# Altium schematic sheet ArDINo Controller.SchDoc: document title
size C; ApprovedBy: Vincent Himpe; CheckedBy: Vincent Himpe; Author: Vincent Himpe; CompanyName: STMicroelectronics; DrawnBy: Vincent Himpe; Organization: BCD Application; Address1: 2525 Augustine Drive; Address2: Santa Clara 95054 CA; Address3: USA; Revision: A; Project: Project title; DrawnByContact: +1 (408) 451 8116; DrawnByEmail: vincent.himpe@st.com
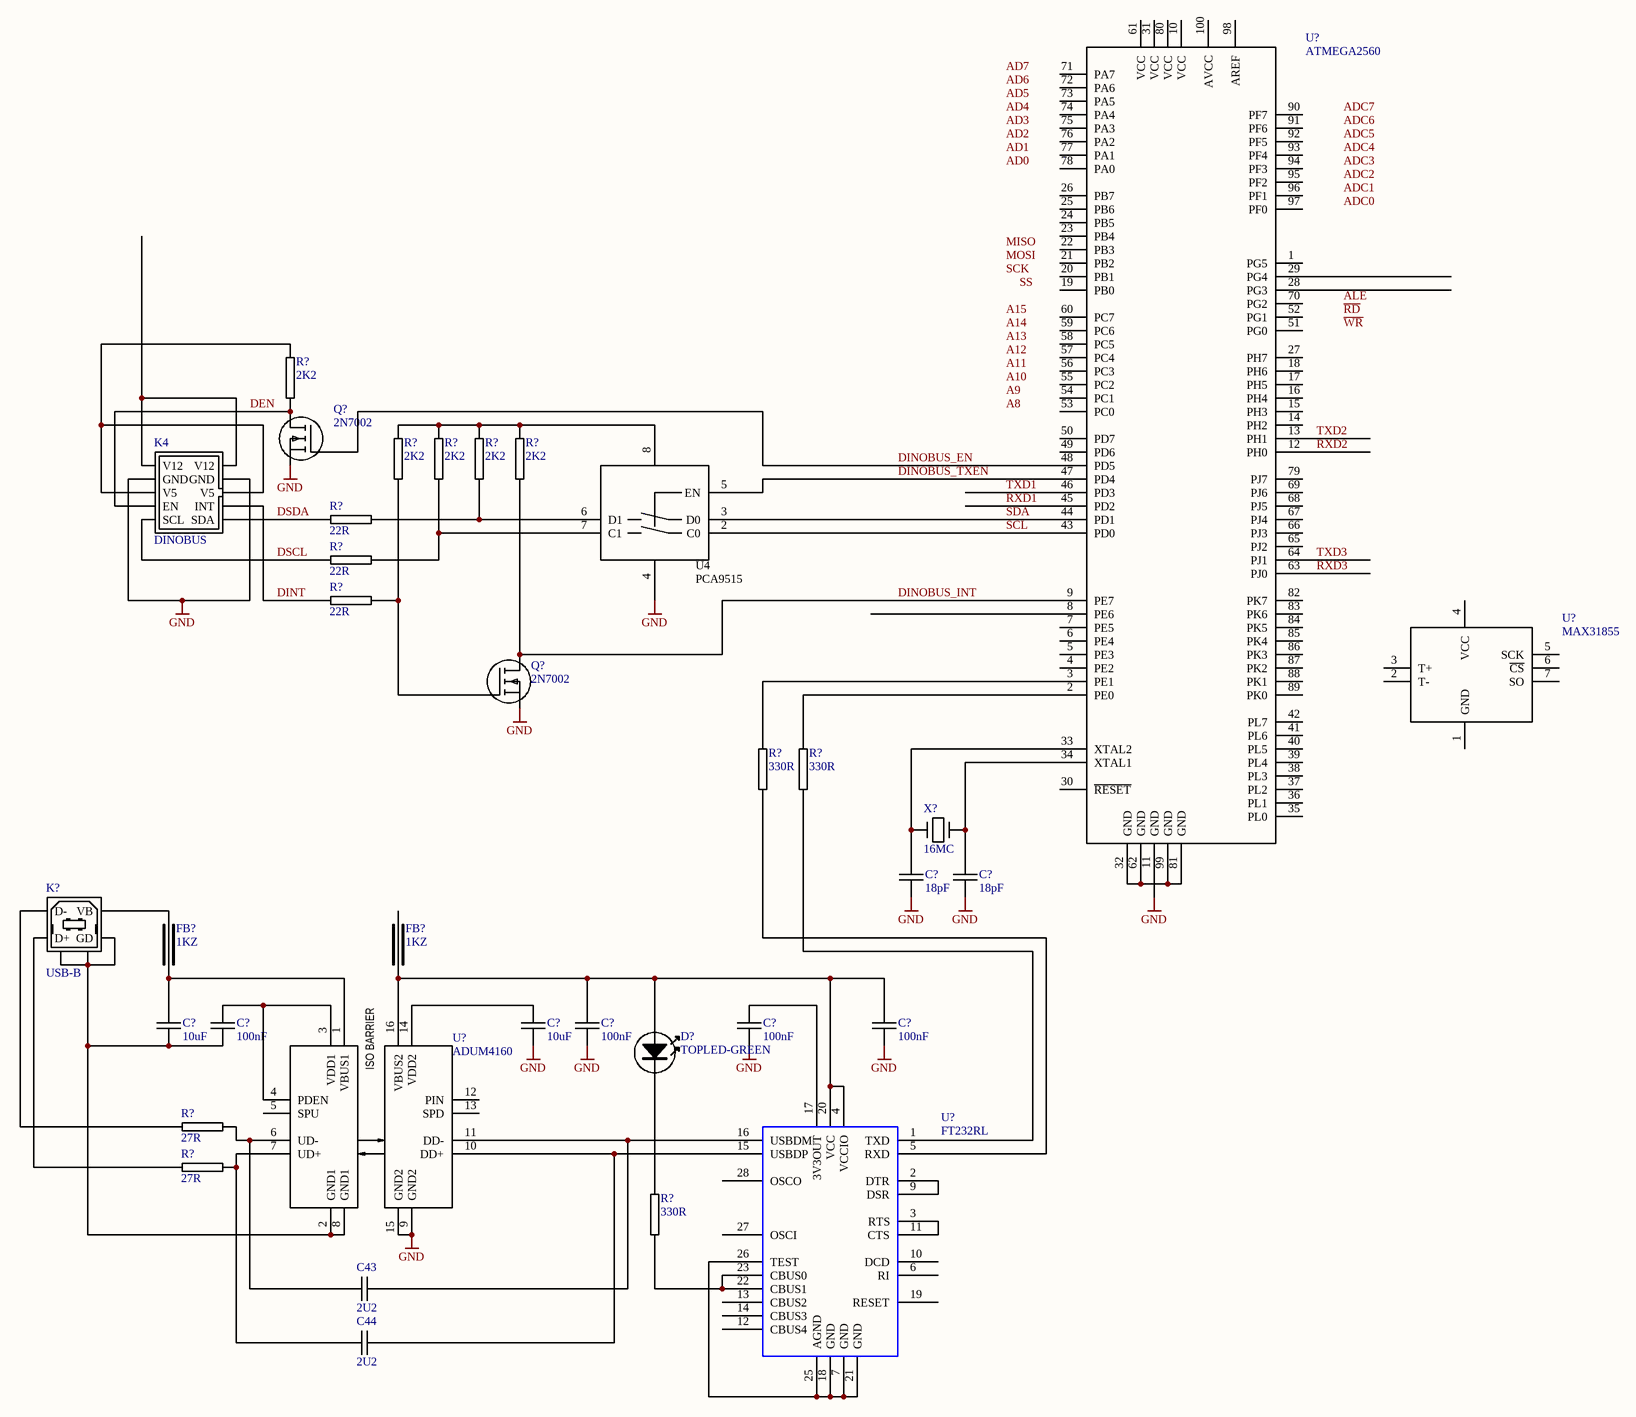
[diagram p0: ArDINo Controller.SchDoc]

## Parts
(Parts that share a designator on the sheet are numbered #1, #2 ... from top to bottom, then left to right.)
C43  2U2  [1206C-GENERIC]
C44  2U2  [1206C-GENERIC]
C?#1  18pF  [0805C-TBD]
C?#2  18pF  [0805C-TBD]
C?#3  10uF  [0805C-GENERIC]
C?#4  100nF  [0805C-TBD]
C?#5  10uF  [0805C-GENERIC]
C?#6  100nF  [0805C-TBD]
C?#7  100nF  [0805C-TBD]
C?#8  100nF  [0805C-TBD]
D?  TOPLED-GREEN  [TOPLED-GREEN]
FB?#1  1KZ  [0805FB-1KZ]
FB?#2  1KZ  [0805FB-1KZ]
K4  DINOBUS  [IDC10-B]
K?  USB-B  [USB-B]
Q?#1  2N7002  [SOT23-GDS]
Q?#2  2N7002  [SOT23-GDS]
R?#1  2K2  [0805R-2K2]
R?#2  2K2  [0805R-2K2]
R?#3  2K2  [0805R-2K2]
R?#4  2K2  [0805R-2K2]
R?#5  2K2  [0805R-2K2]
R?#6  22R  [0805R-22]
R?#7  22R  [0805R-22]
R?#8  22R  [0805R-22]
R?#9  330R  [0805R-330]
R?#10  330R  [0805R-330]
R?#11  27R  [0805R-27]
R?#12  27R  [0805R-27]
R?#13  330R  [0805R-330]
U4  PCA9515  [SO8]
U?#1  ATMEGA2560
U?#2  MAX31855
U?#3  ADUM4160
U?#4  FT232RL  [TSSOP28]
X?  16MC  [XTAL-RU49/4]

## Nets
GND: C?#1.2 C?#2.2 C?#5.2 C?#6.2 C?#7.2 C?#8.2 K4.3(GND) K4.4(GND) Q?#1.S Q?#2.S U4.4(GND) U?#1.11(GND) U?#3.9(GND2) U?#3.15(GND2)
DEN: K4.8(EN) Q?#1.D R?#1.2
DINOBUS_EN: Q?#1.G U?#1.48(PD5)
DINOBUS_INT: Q?#2.D R?#5.2 U?#1.9(PE7)
DINOBUS_TXEN: U4.5(EN) U?#1.47(PD4)
DINT: K4.7(INT) R?#8.1
DSCL: K4.10(SCL) R?#7.1
DSDA: K4.9(SDA) R?#6.1
RXD1: U?#1.45(PD2)
RXD2: U?#1.12(PH0)
RXD3: U?#1.63(PJ0)
SCL: U4.2(C0) U?#1.43(PD0)
SDA: U4.3(D0) U?#1.44(PD1)
TXD1: U?#1.46(PD3)
TXD2: U?#1.13(PH1)
TXD3: U?#1.64(PJ1)
NetC43_1: C43.1 R?#11.2 U?#3.6(UD-)
NetC43_2: C43.2 U?#3.11(DD-) U?#4.16(USBDM)
NetC44_1: C44.1 R?#12.2 U?#3.7(UD+)
NetC44_2: C44.2 U?#3.10(DD+) U?#4.15(USBDP)
NetC?#1_1: C?#1.1 U?#1.33(XTAL2) X?.1
NetC?#2_1: C?#2.1 U?#1.34(XTAL1) X?.2
NetC?#3_1: C?#3.1 FB?#1.2 U?#3.1(VBUS1)
NetC?#3_2: C?#3.2 C?#4.2 K?.4(GD) K?.5 K?.6 U?#3.2(GND1) U?#3.8(GND1)
NetC?#4_1: C?#4.1 U?#3.3(VDD1) U?#3.4(PDEN)
NetC?#5_1: C?#5.1 U?#3.14(VDD2)
NetC?#6_1: C?#6.1 C?#8.1 D?.A FB?#2.2 U?#3.16(VBUS2) U?#4.4(VCCIO) U?#4.20(VCC)
NetC?#7_1: C?#7.1 U?#4.17(3V3OUT)
NetD?_K: D?.K R?#13.1
NetFB?#1_1: FB?#1.1 K?.1(VB)
NetK4_1: K4.1(V12) K4.2(V12)
NetK4_5: K4.5(V5) K4.6(V5) R?#1.1
NetK?_2: K?.2(D-) R?#11.1
NetK?_3: K?.3(D+) R?#12.1
NetQ?#2_G: Q?#2.G R?#2.2 R?#8.2
NetR?#2_1: R?#2.1 R?#3.1 R?#4.1 R?#5.1 U4.8(VCC)
NetR?#3_2: R?#3.2 R?#7.2 U4.7(C1)
NetR?#4_2: R?#4.2 R?#6.2 U4.6(D1)
NetR?#9_1: R?#9.1 U?#1.3(PE1)
NetR?#9_2: R?#9.2 U?#4.5(RXD)
NetR?#10_1: R?#10.1 U?#1.2(PE0)
NetR?#10_2: R?#10.2 U?#4.1(TXD)
NetR?#13_2: R?#13.2 U?#4.22(CBUS1) U?#4.23(CBUS0)
NetU?#1_32: U?#1.32(GND) U?#1.62(GND) U?#1.81(GND) U?#1.99(GND)
NetU?#4_2: U?#4.2(DTR) U?#4.9(DSR)
NetU?#4_3: U?#4.3(RTS) U?#4.11(CTS)
NetU?#4_7: U?#4.7(GND) U?#4.18(GND) U?#4.21(GND) U?#4.25(AGND) U?#4.26(TEST)

Not connected (* = marked no-connect by the designer): FB?#2 1; U?#1 1(PG5) 4(PE2) 5(PE3) 6(PE4) 7(PE5) 8(PE6) 10(VCC) 14(PH2) 15(PH3) 16(PH4) 17(PH5) 18(PH6) 19(PB0) 20(PB1) 21(PB2) 22(PB3) 23(PB4) 24(PB5) 25(PB6) 26(PB7) 27(PH7) 28(PG3) 29(PG4) 30(~{RESET}) 31(VCC) 35(PL0) 36(PL1) 37(PL2) 38(PL3) 39(PL4) 40(PL5) 41(PL6) 42(PL7) 49(PD6) 50(PD7) 51(PG0) 52(PG1) 53(PC0) 54(PC1) 55(PC2) 56(PC3) 57(PC4) 58(PC5) 59(PC6) 60(PC7) 61(VCC) 65(PJ2) 66(PJ3) 67(PJ4) 68(PJ5) 69(PJ6) 70(PG2) 71(PA7) 72(PA6) 73(PA5) 74(PA4) 75(PA3) 76(PA2) 77(PA1) 78(PA0) 79(PJ7) 80(VCC) 82(PK7) 83(PK6) 84(PK5) 85(PK4) 86(PK3) 87(PK2) 88(PK1) 89(PK0) 90(PF7) 91(PF6) 92(PF5) 93(PF4) 94(PF3) 95(PF2) 96(PF1) 97(PF0) 98(AREF) 100(AVCC); U?#2 1(GND) 2(T-) 3(T+) 4(VCC) 5(SCK) 6(~{CS}) 7(SO); U?#3 5(SPU) 12(PIN) 13(SPD); U?#4 6(RI) 10(DCD) 12(CBUS4) 13(CBUS2) 14(CBUS3) 19(RESET) 27(OSCI) 28(OSCO)

## Notes on the sheet
- Labels drawn without touching a wire or pin: A8, A9, A10, A11, A12, A13, A14, A15, AD0, AD1, AD2, AD3, AD4, AD5, AD6, AD7, ADC0, ADC1, ADC2, ADC3, ADC4, ADC5, ADC6, ADC7, ALE, MISO, MOSI, SCK, SS, ~{RD}, ~{WR}
- PROJECT
- STMicroelectronics
- Last Modified
- Sheet
- of
- Document
- Revision
- Drawn By
- Information in this document is the intellectual property of STMicroelectronics.Disclosure outside of STMicroelectronics is prohibited without prior written approval. Contents may be subject to Patent or Patent application.
- 2525 Augustine Drive
- Santa Clara 95054 CA
- USA
- (in symbol ADUM4160) ISO BARRIER

## Library data of the parts
C43 C44 = 1206C-2U2-50V: CAPACITOR 0603 CERAMIC; REEL: C100; Supplier 1: Digi-Key; Supplier Part Number 1: 490-4796-2-ND
C?#1 C?#2 = 0805C-18PF-50V-C0G-JOH: CAPACITOR 0805 CERAMIC; Supplier 1: Digi-Key; Supplier Part Number 1: 709-1171-2-ND
C?#3 C?#5 = 0805C-10UF-6V3-X5R-PAN: CAPACITOR 0805 CERAMIC; Manufacturer: Panasonic - ECG; Manufacturer Part Number: ECJ-2FB0J106M; Reel: C1; Capacitance: 10µF; Voltage - Rated: 6.3V; Temperature Coefficient: X5R; Tolerance: ±20%; Description: CAP 10UF 6.3V CERAMIC X5R 0805; Supplier 1: Digi-Key; Supplier Part Number 1: PCC2225TR-ND; Supplier: Digi-Key; Operating Temperature: -55°C ~ 85°C; Mounting Type: Surface Mount, MLCC; Lead Spacing: -; RoHS: RoHS Compliant; Packaging: Tape & Reel (TR); Thickness: 1.25mm; Package / Case: 0805 (2012 metric); Features: General Purpose; Category: Capacitors; Supplier Part Number: PCC2225TR-ND
C?#4 C?#6-C?#8 = 0805C-100nF-25V-X7R-MUR: CAPACITOR 0805 CERAMIC; Supplier 1: Digi-Key; Supplier Part Number 1: 490-1673-1-ND
FB?#1 FB?#2 = 0805FB-1KZ: FERRITE BEAD 1000 OHM 6A; Reel: F3
K4 = DINOBUS: BOXHEADER 10 PIN; Manufacturer: Assmann Electronics Inc; Manufacturer Part Number: AWHW10G-0202-T-R; Connector Type: Header, Shrouded; Description: CONN HEADER LOW-PRO 10POS GOLD; Number of Positions: 10; Number of Positions Loaded: All; Pitch: 0.100" (2.54mm); Supplier 1: Digi-Key; Supplier Part Number 1: HRP10H-ND; Supplier: Digi-Key; Contact Type: Male Pin; RoHS: RoHS Compliant; Supplier Part Number: HRP10H-ND; Category: Connectors, Interconnects; Number of Rows: 2; Row Spacing: 0.100" (2.54mm); Contact Mating Length: -; Mounting Type: Through Hole; Termination: Solder; Fastening Type: -; Features: -; Contact Finish: Gold; Contact Finish Thickness: Flash; Color: Gray; Packaging: Tray
K? = USB-B: USB B DEVICE CONNECTOR; Text Field1: Assmann; Text Field2: AU-Y1007; Text Field3: Digi-Key; Text Field4: AE1085-ND; Text Field5: Thru-Hole; Text Field6: 1.168; NI?: *; O?: *; Section:: *
Q?#1 Q?#2 = 2N7002-SOT23: N CHANNEL MOSFET 2N7002 SOT23; Manufacturer: Fairchild Semiconductor; Drain to Source Voltage (Vdss): 60V; Vgs(th) (Max) @ Id: 2.5V @ 250µA; Power - Max: 200mW; Current - Continuous Drain (Id) @ 25° C: 115mA; Rds On (Max) @ Id, Vgs: 7.5 Ohm @ 500mA, 10V; FET Type: MOSFET N-Channel, Metal Oxide; FET Feature: Logic Level Gate; Input Capacitance (Ciss) @ Vds: 50pF @ 25V; Description: MOSFET N-CH 60V 115MA SOT-23; Reel: Q2; Supplier 1: Digi-Key; Supplier Part Number 1: 2N7002NTR-ND; Package / Case: SOT-23-3, TO-236-3, Micro3™, SSD3, SST3; RoHS: RoHS Compliant; Mounting Type: Surface Mount; Packaging: Tape & Reel (TR); Gate Charge (Qg) @ Vgs: -; Supplier Part Number: 2N7002NTR-ND; Supplier: Digi-Key; Category: Discrete Semiconductor Products; Manufacturer Part Number: 2N7002
R?#1-R?#5 = 0805R-2K2: RESISTOR 0805 1/4 WATT THIN FILM; Reel: *
R?#6-R?#8 = 0805R-22: RESISTOR 0805 1/4 WATT THIN FILM; Reel: *
R?#9 R?#10 R?#13 = 0805R-330: RESISTOR 0805 1/4 WATT THIN FILM; Reel: *
R?#11 R?#12 = 0805R-27: RESISTOR 0805 1/4 WATT THIN FILM; Reel: *
U4 = PCA9515: I2 BUS ISOLATOR; Supplier 1: Digi-Key; Supplier Part Number 1: 568-1031-6-ND
U?#1 = ATMEGA2560: ATMEL ATMEGA CPU; Supplier 1: Digi-Key; Supplier Part Number 1: ATMEGA2560-16AUR-ND
U?#3 = ADUM4160: USB Isolator; Supplier 1: Digi-Key; Supplier Part Number 1: ADUM4160BRWZ-ND
U?#4 = FT232RL: USB TO UART INTERFACE; Manufacturer: FTDI, Future Technology Devices International Ltd; Manufacturer Part Number: FT232RL R; Number of Channels: 8; Description: IC USB TO SERIAL UART 28-SSOP; Voltage: 3.3 V ~ 5.25 V; FIFO's: 256 Byte; Supplier 1: Digi-Key; Supplier Part Number 1: 768-1007-2-ND; RoHS: RoHS Compliant; Features: Serial Interface; Package / Case: 28-SSOP; Supplier: Digi-Key; Packaging: Tape & Reel (TR); Supplier Part Number: 768-1007-2-ND; Category: Integrated Circuits (ICs)
X? = 16MC-HC49US: 16MHz; Supplier 1: Mouser; Supplier Part Number 1: 815-ABLS-16.0M-T